# Altium schematic sheet MCP6004T.schdoc
size 52 x 42 mm
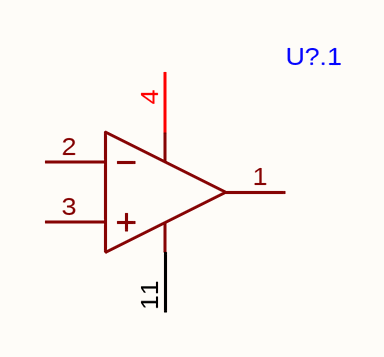
[diagram p0: MCP6004T.schdoc]

## Parts
U?.1  (no value)  [SOIC-14_L8.7-W3.9-P1.27-LS6.0-BL]

## Nets

Not connected (* = marked no-connect by the designer): U?.1 1(VOUT_A) 2(VIN_A-) 3(VIN_A+) 4(VDD) 11(VSS)

## Library data of the parts
U?.1 = MCP6004T-I/SLGVAO